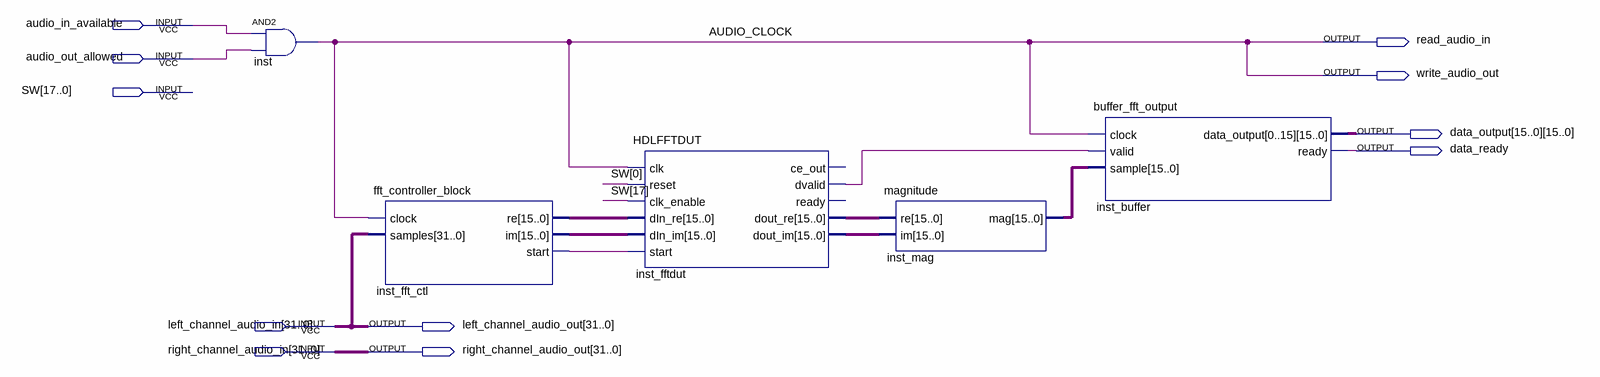
[diagram p0: schematic sheet]
// Quartus schematic filter_demo.bdf as structural Verilog: 5 symbols, 11 pins
module filter_demo (
  input  audio_in_available,
  input  audio_out_allowed,
  input  [17:0] SW,
  input  [31:0] left_channel_audio_in,
  input  [31:0] right_channel_audio_in,
  output read_audio_in,
  output write_audio_out,
  output [15:0] data_output_15,
  output [15:0] data_output_14,
  output [15:0] data_output_13,
  output [15:0] data_output_12,
  output [15:0] data_output_11,
  output [15:0] data_output_10,
  output [15:0] data_output_9,
  output [15:0] data_output_8,
  output [15:0] data_output_7,
  output [15:0] data_output_6,
  output [15:0] data_output_5,
  output [15:0] data_output_4,
  output [15:0] data_output_3,
  output [15:0] data_output_2,
  output [15:0] data_output_1,
  output [15:0] data_output_0,
  output data_ready,
  output [31:0] left_channel_audio_out,
  output [31:0] right_channel_audio_out
);

  wire inst_fft_ctl_start, inst_fftdut_dvalid;
  wire [15:0] inst_fft_ctl_im, inst_fft_ctl_re, inst_fftdut_dout_im, inst_fftdut_dout_re, inst_mag_mag;

  and inst (read_audio_in, audio_in_available, audio_out_allowed);
  fft_controller_block inst_fft_ctl (
    .clock(read_audio_in), .samples(left_channel_audio_in), .re(inst_fft_ctl_re), .im(inst_fft_ctl_im),
    .start(inst_fft_ctl_start));
  HDLFFTDUT inst_fftdut (
    .clk(read_audio_in), .reset(SW[0]), .clk_enable(SW[17]), .dIn_re(inst_fft_ctl_re),
    .dIn_im(inst_fft_ctl_im), .start(inst_fft_ctl_start), .dvalid(inst_fftdut_dvalid),
    .dout_re(inst_fftdut_dout_re), .dout_im(inst_fftdut_dout_im));  // open: ce_out, ready
  magnitude inst_mag (.re(inst_fftdut_dout_re), .im(inst_fftdut_dout_im), .mag(inst_mag_mag));
  buffer_fft_output inst_buffer (
    .clock(read_audio_in), .valid(inst_fftdut_dvalid), .sample(inst_mag_mag),
    .data_output({data_output_15, data_output_14, data_output_13, data_output_12, data_output_11, data_output_10, data_output_9, data_output_8, data_output_7, data_output_6, data_output_5, data_output_4, data_output_3, data_output_2, data_output_1, data_output_0}),
    .ready(data_ready));

  assign left_channel_audio_out = left_channel_audio_in;
  assign right_channel_audio_out = right_channel_audio_in;
  assign write_audio_out = read_audio_in;

  // Other names for the same wires on the sheet: AUDIO_CLOCK = read_audio_in
endmodule
